# Altium project AMS1117 breakout.PrjPCB
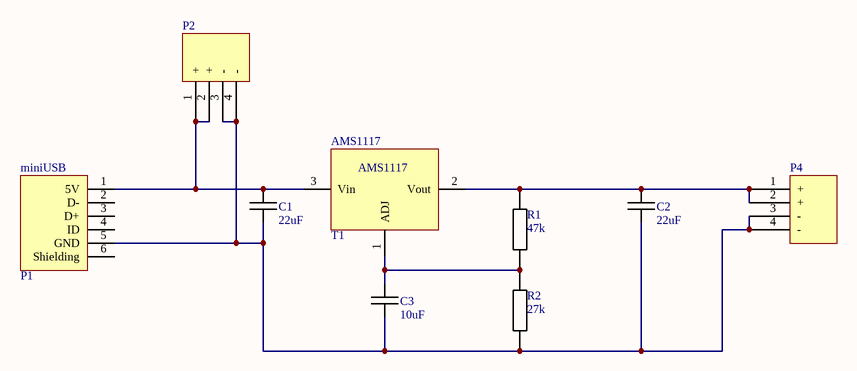
[diagram p0: AMS1117 breakout.SchDoc]
1 sheet, 9 parts. Net scope: global (net labels, ports and power ports of the same name join across sheets).
Board file: AMS1117 breakout.PcbDoc

## Sheet AMS1117 breakout.SchDoc
size A4

### Parts
AMS1117  T1  [SOT-223]
C1  22uF  [0805-C]
C2  22uF  [0805-C]
C3  10uF  [0805-C]
miniUSB  P1
P2  Header 4pin  (value not drawn)
P4  Header 4pin  (value not drawn)
R1  47k  [0805-R]
R2  27k  [0805-R]

### Nets
NetAMS1117_1: AMS1117.1(ADJ) C3.2 R1.1 R2.2
NetAMS1117_2: AMS1117.2(Vout) C2.2 P4.1(+) P4.2(+) R1.2
NetAMS1117_3: AMS1117.3(Vin) C1.2 miniUSB.1(5V) P2.1(+) P2.2(+)
NetC1_1: C1.1 C2.1 C3.1 miniUSB.5(GND) P2.3(-) P2.4(-) P4.3(-) P4.4(-) R2.1

Not connected (* = marked no-connect by the designer): miniUSB 2(D-) 3(D+) 4(ID) 6(Shielding)

### Library data of the parts
AMS1117 = AMS1117
C1-C3 = Capacitor
miniUSB = miniUSB
R1 R2 = Resistor